# EAGLE design Flipper-AVR-ATTiny (EAGLE 9.6.2)
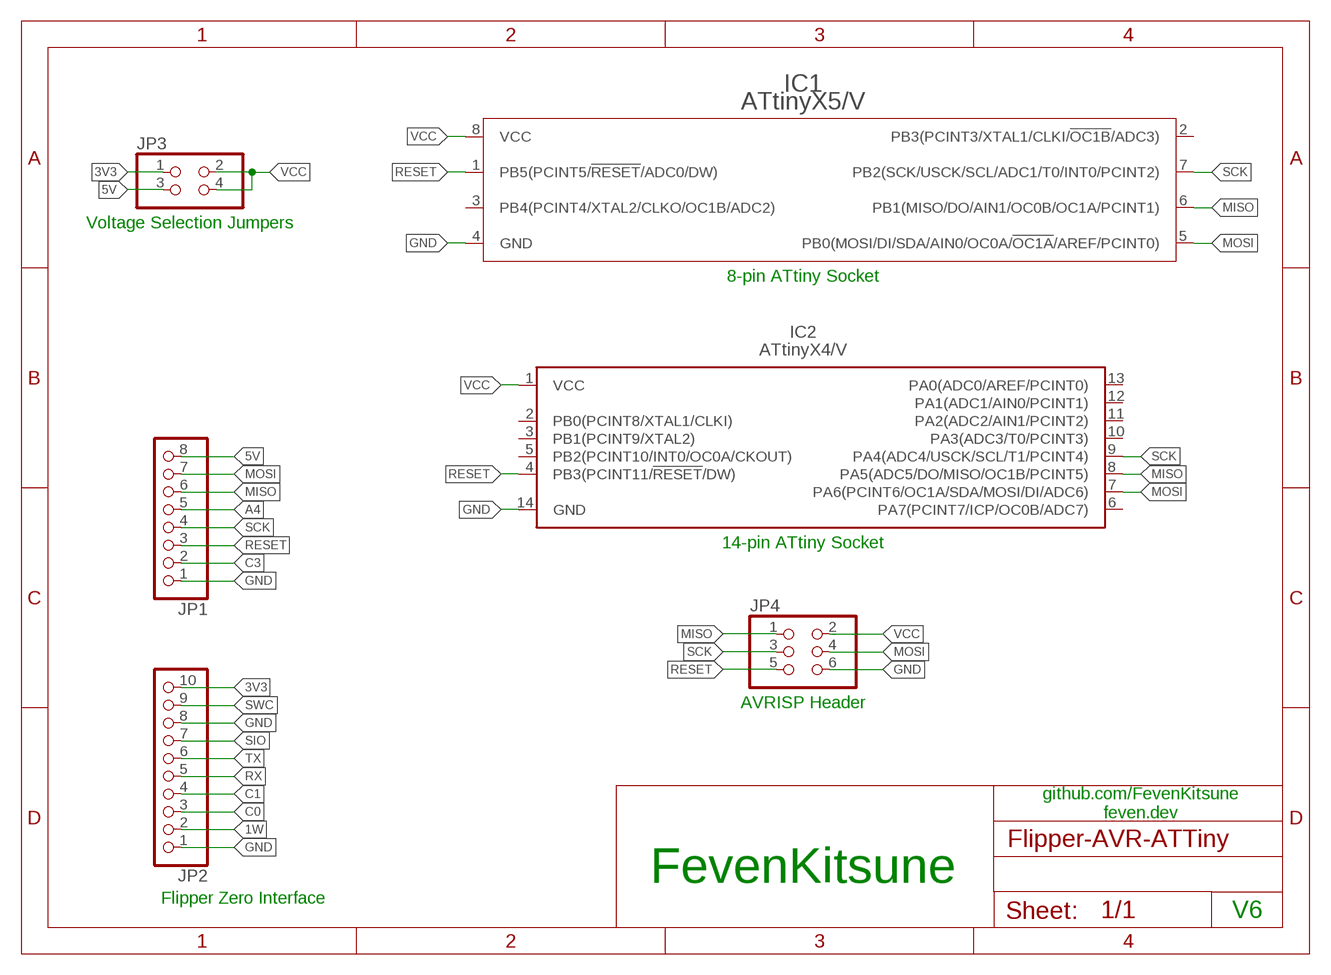
[diagram p0: schematic, sheet 1]

## Parts
IC1  ATtinyX5/V  ATTINY85V-10PU-8PIN_PDIP  [DIP787W55P254L958H533Q8B-8P3]
IC2  ATtinyX4/V  ATTINY84V-10PU-14PIN_PDIP  [DIP762W55P254L1917H533Q14B]
JP1  PINHD-1X8  [1X08]
JP2  PINHD-1X10  [1X10]
JP3  PINHD-2X2  [2X02]
JP4  PINHD-2X3  [2X03]

## Nets
1W: JP2.2
3V3: JP2.10 JP3.1
5V: JP1.8 JP3.3
A4: JP1.5
C0: JP2.3
C1: JP2.4
C3: JP1.2
GND: IC1.4(GND) IC2.14(GND) JP1.1 JP2.1 JP2.8 JP4.6
MISO: IC1.6(PB1(MISO/DO/AIN1/OC0B/OC1A/PCINT1)) IC2.8(PA5(ADC5/DO/MISO/OC1B/PCINT5)) JP1.6 JP4.1
MOSI: IC1.5(PB0(MOSI/DI/SDA/AIN0/OC0A/!OC1A!/AREF/PCINT0)) IC2.7(PA6(PCINT6/OC1A/SDA/MOSI/DI/ADC6)) JP1.7 JP4.4
RESET: IC1.1(PB5(PCINT5/!RESET!/ADC0/DW)) IC2.4(PB3(PCINT11/!RESET!/DW)) JP1.3 JP4.5
RX: JP2.5
SCK: IC1.7(PB2(SCK/USCK/SCL/ADC1/T0/INT0/PCINT2)) IC2.9(PA4(ADC4/USCK/SCL/T1/PCINT4)) JP1.4 JP4.3
SIO: JP2.7
SWC: JP2.9
TX: JP2.6
VCC: IC1.8(VCC) IC2.1(VCC) JP3.2 JP3.4 JP4.2
Unconnected: IC1.2(PB3(PCINT3/XTAL1/CLKI/!OC1B!/ADC3)) IC1.3(PB4(PCINT4/XTAL2/CLKO/OC1B/ADC2)) IC2.2(PB0(PCINT8/XTAL1/CLKI)) IC2.3(PB1(PCINT9/XTAL2)) IC2.5(PB2(PCINT10/INT0/OC0A/CKOUT)) IC2.6(PA7(PCINT7/ICP/OC0B/ADC7)) IC2.10(PA3(ADC3/T0/PCINT3)) IC2.11(PA2(ADC2/AIN1/PCINT2)) IC2.12(PA1(ADC1/AIN0/PCINT1)) IC2.13(PA0(ADC0/AREF/PCINT0))

## Notes on the sheet
- Voltage Selection Jumpers
- 8-pin ATtiny Socket
- 14-pin ATtiny Socket
- AVRISP Header
- github.com/FevenKitsune
  feven.dev
- FevenKitsune
- Flipper Zero Interface
- V6

## Library data of the parts
IC1 = IC_Embedded:ATTINY*-8PIN: Atmel tiny25/45/85, 8-bit AVR Microcontroller with 2/4/8K Bytes In-System Programmable Flash Datasheet <https://ww1.microchip.com/downloads/en/DeviceDoc/Atmel-2586-AVR-8-bit-Microcontroller-ATtiny25-ATtiny45-ATtiny85_Datasheet.pdf>; CATEGORY: IC_Embedded; CORE: AVR; DESCRIPTION: AVR AVR® ATtiny, Functional Safety (FuSa) Microcontroller IC 8-Bit 10MHz 8KB (4K x 16) FLASH 8-PDIP; MANUFACTURER: Microchip Technology; MPN: ATtiny85V-10PU; OPERATING_TEMP: -40°C to 85°C; PART_STATUS: Active; ROHS_COMPLIANT: COMPLIANT; SERIES: ATtiny85; SPEED: 10 MHz; SUB-CATEGORY: Microcontroller; TYPE: AVR Microcontroller; VALUE: ATtiny85V-10PU
IC2 = IC_Embedded:ATTINY*-14PIN: Atmel tiny24/44/84, 8-bit Microcontroller with 2/4/8K Bytes In-System Programmable Flash Datasheet <http://ww1.microchip.com/downloads/en/DeviceDoc/doc8006.pdf>; CATEGORY: IC_Embedded; DESCRIPTION: AVR AVR® ATtiny Microcontroller IC 8-Bit 10MHz 8KB (4K x 16) FLASH 14-PDIP; MANUFACTURER: Microchip Technology; MPN: ATtiny84V-10PU; OPERATING_TEMP: -40°C to +85°C; PART_STATUS: Active; ROHS_COMPLIANT: COMPLIANT; SERIES: ATtiny84; SPEED: 10 MHz; SUB-CATEGORY: Microcontroller; TYPE: AVR Microcontroller; VALUE: ATtiny84V-10PU
JP1 = pinhead:PINHD-1X8: PIN HEADER
JP2 = pinhead:PINHD-1X10: PIN HEADER
JP3 = pinhead:PINHD-2X2: PIN HEADER
JP4 = pinhead:PINHD-2X3: PIN HEADER

## Board
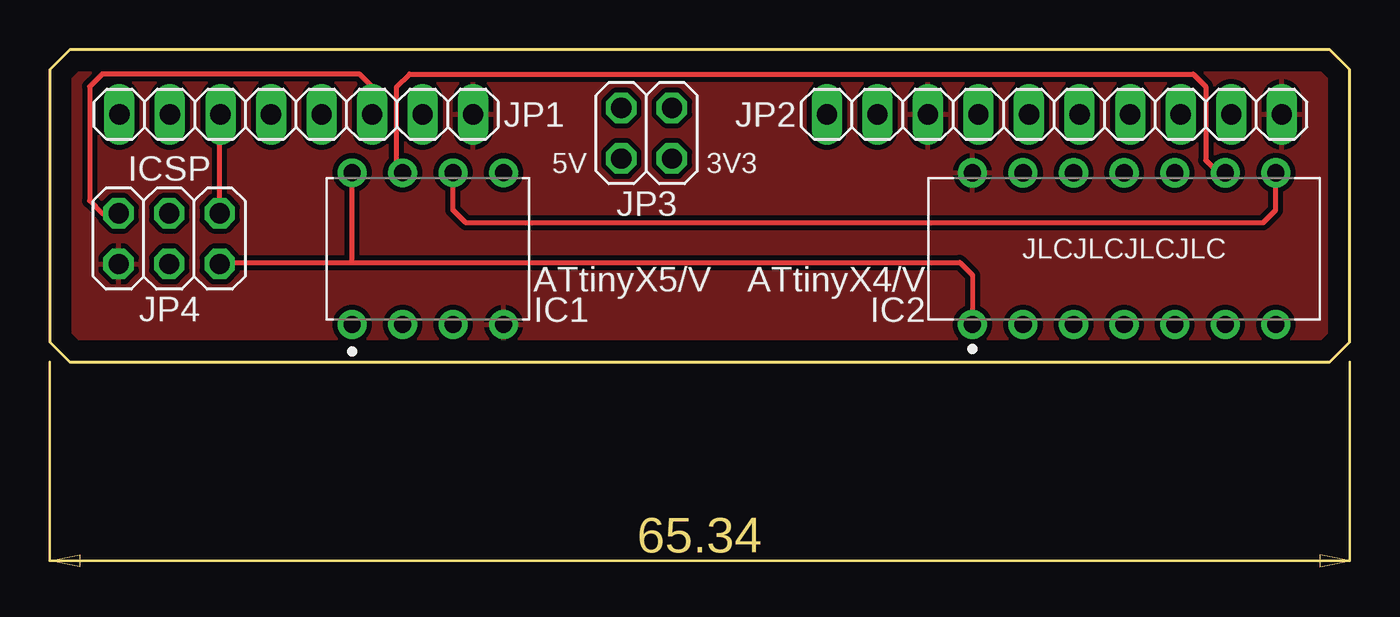
[diagram p1: board, top side]
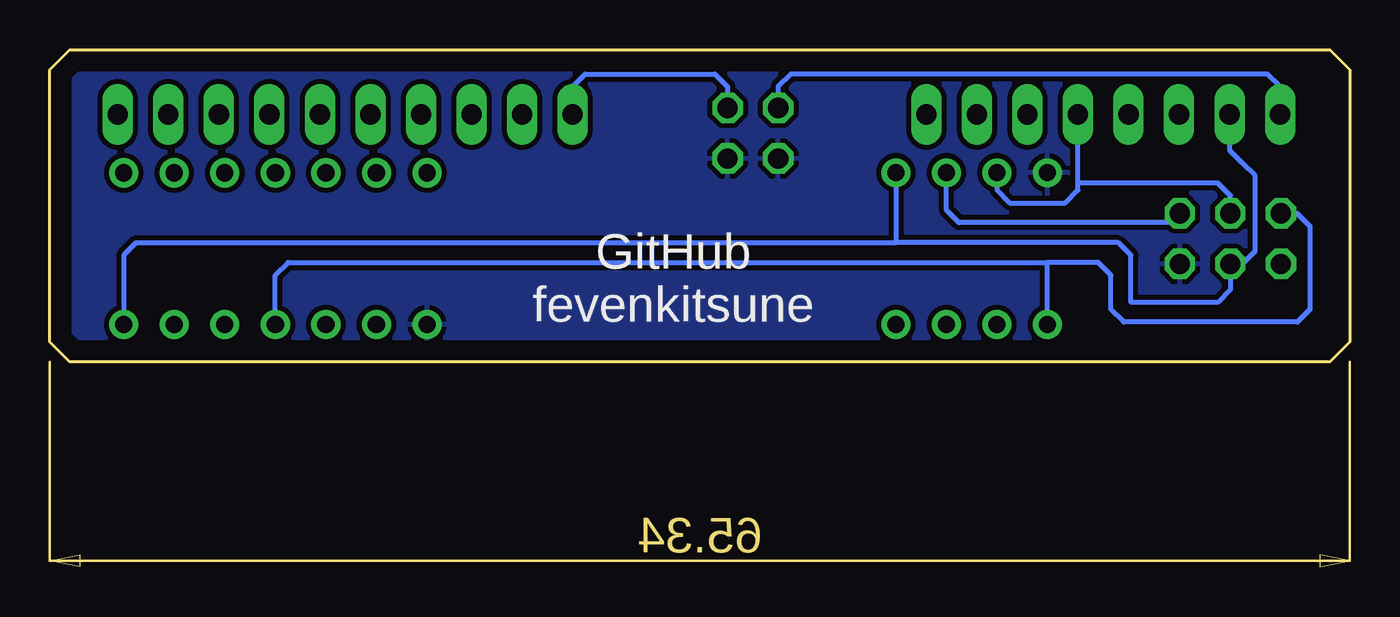
[diagram p2: board, bottom side, seen from below]

Size 65.34 x 15.7 mm. Coordinates in mm from the lower left corner, seen from the top.
Outline: 0,14.7 0,1 1,0 64.34,0 65.34,1 65.34,14.7 64.34,15.7 1,15.7 0,14.7
Copper layers (1*16): Top 0.035mm / dielectric 1.5mm / Bottom 0.035mm
Design rules "default *": minimum track width 6mil, minimum drill 0.35mm, track to track 10mil, track to pad 10mil, pad to pad 10mil, via to via 10mil, smd to smd 6mil, copper to edge 40mil, drill to drill 6mil, minimum pad ring 10mil, minimum via ring 8mil, stop-mask expansion 4mil, vias tented up to drill 0mil, thermal gap 10mil

### Footprints (pad centres in the part's own frame; a part is rotated, then mirrored left to right if it is on the bottom)
DIP787W55P254L958H533Q8B-8P3 = drill 0.852 pad 1.452: 1 -3.81,3.81; 2 -3.81,1.27; 3 -3.81,-1.27; 4 -3.81,-3.81; 5 3.81,-3.81; 6 3.81,-1.27; 7 3.81,1.27; 8 3.81,3.81
DIP762W55P254L1917H533Q14B = drill 0.863 pad 1.463: 1 -3.81,7.62; 2 -3.81,5.08; 3 -3.81,2.54; 4 -3.81,0; 5 -3.81,-2.54; 6 -3.81,-5.08; 7 -3.81,-7.62; 8 3.81,-7.62; 9 3.81,-5.08; 10 3.81,-2.54; 11 3.81,0; 12 3.81,2.54; 13 3.81,5.08; 14 3.81,7.62
1X08 = drill 1.016 long: 1 -8.89,0; 2 -6.35,0; 3 -3.81,0; 4 -1.27,0; 5 1.27,0; 6 3.81,0; 7 6.35,0; 8 8.89,0
1X10 = drill 1.016 long: 1 -11.43,0; 2 -8.89,0; 3 -6.35,0; 4 -3.81,0; 5 -1.27,0; 6 1.27,0; 7 3.81,0; 8 6.35,0; 9 8.89,0; 10 11.43,0
2X02 = drill 1.016 octagon: 1 -1.27,-1.27; 2 -1.27,1.27; 3 1.27,-1.27; 4 1.27,1.27
2X03 = drill 1.016 octagon: 1 -2.54,-1.27; 2 -2.54,1.27; 3 0,-1.27; 4 0,1.27; 5 2.54,-1.27; 6 2.54,1.27

### Placement (x,y rotation side)
IC1  19,5.7 90 top
IC2  54,5.7 90 top
JP1  12.39,12.45 180 top
JP2  50.49,12.45 180 top
JP3  30,11.5 180 top
JP4  6,6.2 180 top

### Tracks (layer width: path | path; a pad name or v marks a point on that pad's centre or on a via)
3V3
  Bottom 0.254: JP2.10 39.06,13.85 38.42,14.48 31.91,14.48 31.27,13.85 JP3.1
5V
  Bottom 0.254: JP1.8 3.5,13.85 4.13,14.48 28.09,14.48 28.73,13.85 JP3.3
GND
  pour Top: 0,14.7 1,15.7 64.34,15.7 65.34,14.7 65.34,1 64.34,0 1,0 0,1
MISO
  Top 0.254: JP4.1 8.54,12.41 JP1.6 | IC1.6 20.27,7.63 20.91,7 60.98,7 61.62,7.63 IC2.8
  Bottom 0.254: JP4.1 9.01,7 19.64,7 20.27,7.63 IC1.6
MOSI
  Bottom 0.254: JP1.7 6.04,10.63 5.41,10 5.39,10 4.75,9.37 4.75,5.57 5.39,4.93 JP4.4 6,3.63 6.63,3 11,3 11,5.37 11.63,6 22.81,6 | 22.81,6 60.98,6 61.62,5.37 IC2.7 | IC1.5 22.81,6
RESET
  Top 0.254: JP1.3 16.2,13.85 15.56,14.48 2.63,14.48 2,13.85 2,8.11 2.63,7.47 JP4.5
  Bottom 0.254: 15.19,5 53.37,5 54,4.37 IC2.4 | JP4.5 2.63,7.47 2,6.83 2,2.63 2.63,2 11.37,2 12,2.63 12,4.37 12.63,5 15.19,5 | IC1.1 15.19,5
SCK
  Top 0.254: IC1.7 17.45,9.79 17.45,13.85 18.08,14.48 57.47,14.48 58.1,13.85 58.1,10.14 58.73,9.51 IC2.9
  Bottom 0.254: 13.66,9 13.66,8.63 14.29,8 17.09,8 17.73,8.63 IC1.7 | 13.66,9 JP1.4 | JP4.3 6,8.37 6.63,9 13.66,9
VCC
  Top 0.254: JP4.2 8.61,5 15.19,5 | 15.19,5 IC1.8 | 15.19,5 45.74,5 46.38,4.37 IC2.1
  pour Bottom: 0,1 1,0 64.34,0 65.34,1 65.34,14.7 64.34,15.7 1,15.7 0,14.7

### Text on the board
tPlace: 5V | 3V3 | ICSP | JLCJLCJLCJLC
bPlace: GitHub / fevenkitsune